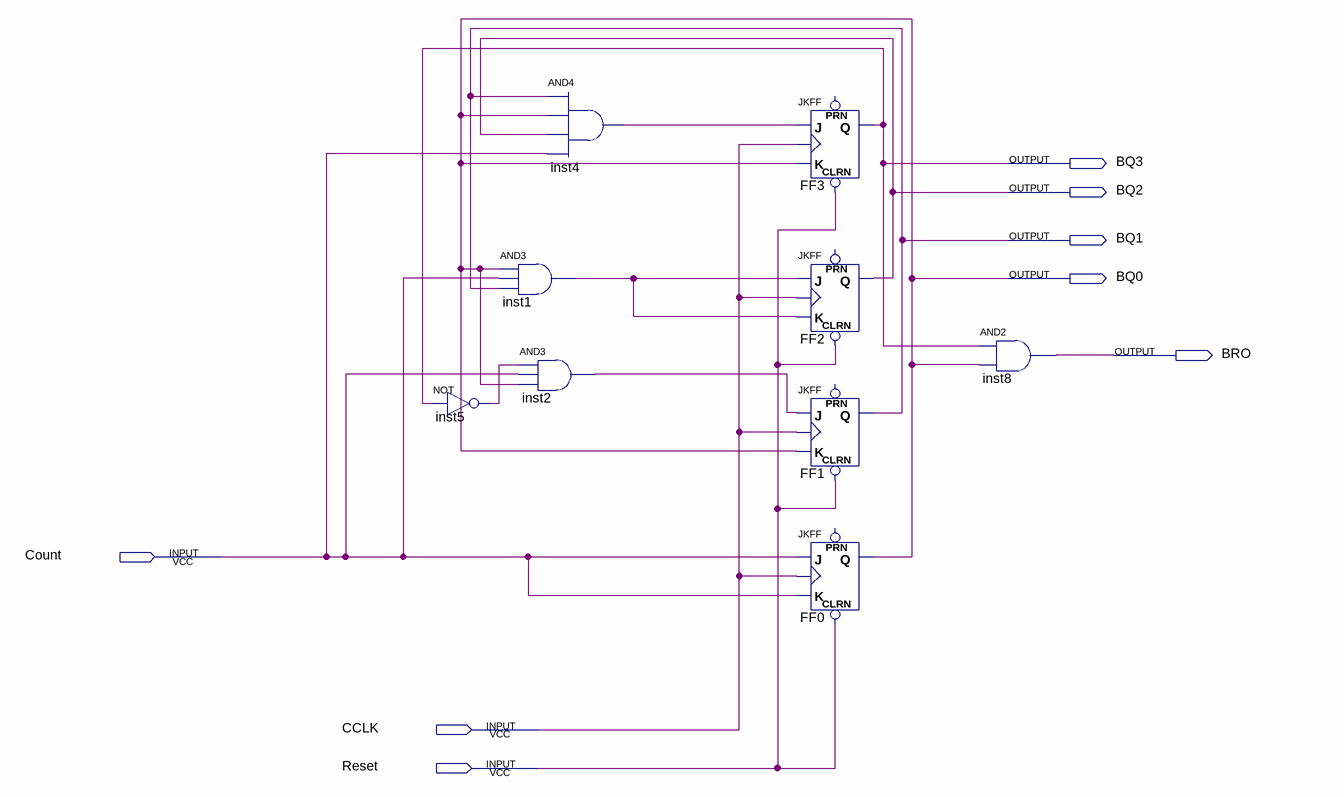
[diagram p0: schematic sheet]
// Quartus schematic BCD Counter.bdf as structural Verilog: 9 symbols, 8 pins
module \BCD_Counter  (
  input  Count,
  input  CCLK,
  input  Reset,
  output BQ3,
  output BQ2,
  output BQ1,
  output BQ0,
  output BRO
);

  wire inst1_out, inst2_out, inst4_out, inst5_out;

  not inst5 (inst5_out, BQ3);
  and inst1 (inst1_out, BQ0, Count, BQ1);
  and inst2 (inst2_out, inst5_out, Count, BQ0);
  and inst4 (inst4_out, BQ1, BQ0, BQ2, Count);
  JKFF FF3 (.CLRN(Reset), .K(BQ0), .J(inst4_out), .CLK(CCLK), .Q(BQ3));  // open: PRN
  JKFF FF2 (.CLRN(Reset), .K(inst1_out), .J(inst1_out), .CLK(CCLK), .Q(BQ2));  // open: PRN
  JKFF FF1 (.CLRN(Reset), .K(BQ0), .J(inst2_out), .CLK(CCLK), .Q(BQ1));  // open: PRN
  JKFF FF0 (.CLRN(Reset), .K(Count), .J(Count), .CLK(CCLK), .Q(BQ0));  // open: PRN
  and inst8 (BRO, BQ3, BQ0);
endmodule
